# Altium schematic sheet toplevel.SchDoc
size A
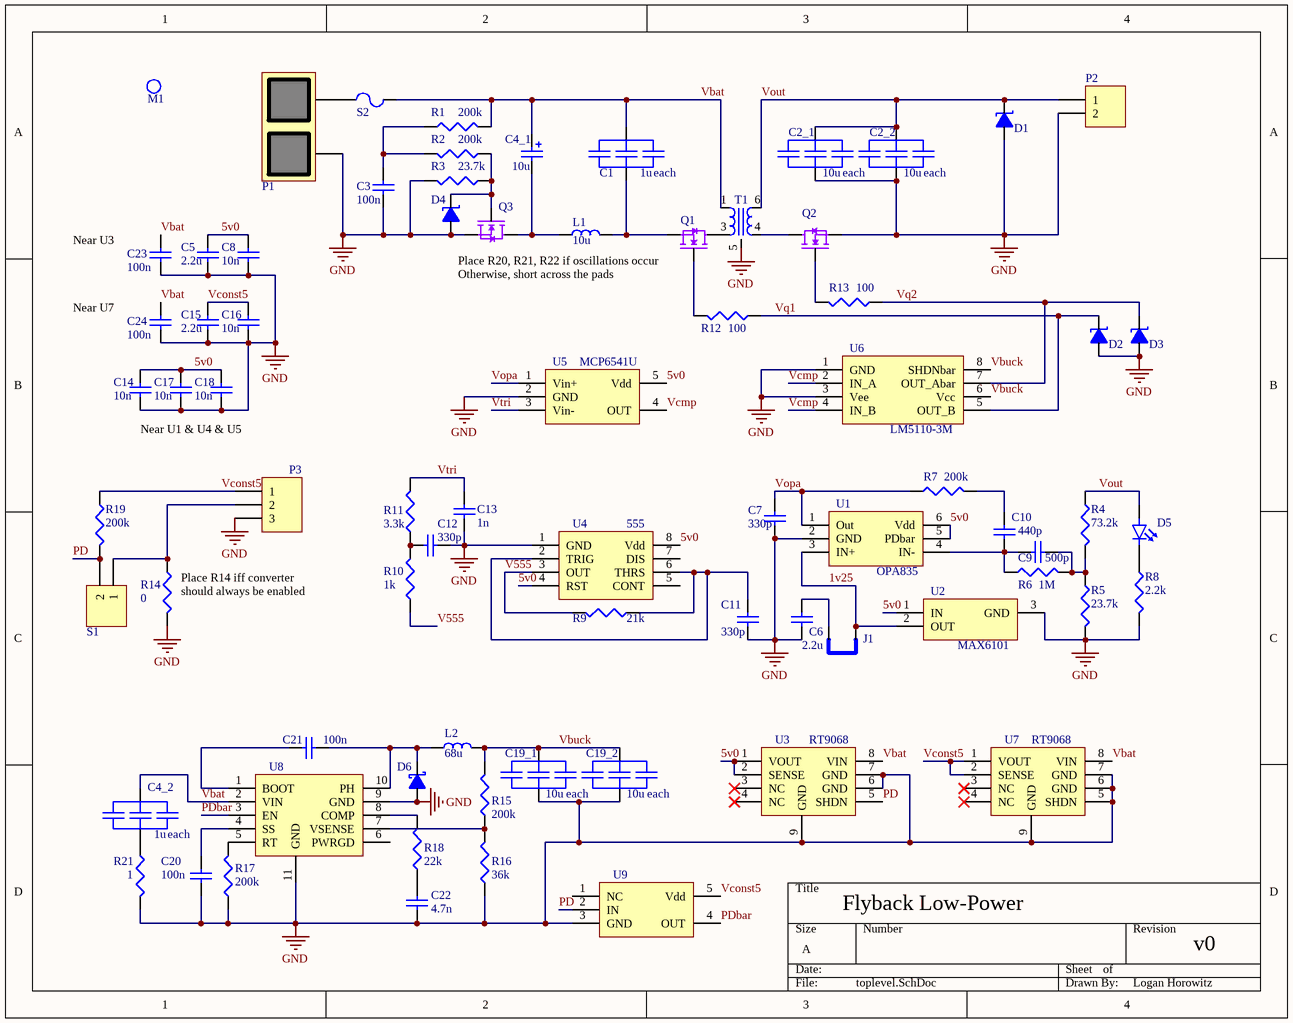
[diagram p0: toplevel.SchDoc]

## Parts
C1  value 1u  [tricap_0805]  (hidden comment: TriCap)
C2_1  value 10u  [tricap_0603]  (hidden comment: TriCap)
C2_2  value 10u  [tricap_0603]  (hidden comment: TriCap)
C3  value 100n  [SMD0603_cap]  (hidden comment: Cap)
C4_1  value 10u  [cap_radial_d]  (hidden comment: Cap)
C4_2  value 1u  [tricap_0805]  (hidden comment: TriCap)
C5  value 2.2u  [SMD0603_cap]  (hidden comment: Cap)
C6  value 2.2u  [SMD0603_cap]  (hidden comment: Cap)
C7  value 330p  [SMD0603_cap]  (hidden comment: Cap)
C8  value 10n  [SMD0603_cap]  (hidden comment: Cap)
C9  value 500p  [SMD0603_cap]  (hidden comment: Cap)
C10  value 440p  [SMD0603_cap]  (hidden comment: Cap)
C11  value 330p  [SMD0603_cap]  (hidden comment: Cap)
C12  value 330p  [SMD0603_cap]  (hidden comment: Cap)
C13  value 1n  [SMD0603_cap]  (hidden comment: Cap)
C14  value 10n  [SMD0603_cap]  (hidden comment: Cap)
C15  value 2.2u  [SMD0603_cap]  (hidden comment: Cap)
C16  value 10n  [SMD0603_cap]  (hidden comment: Cap)
C17  value 10n  [SMD0603_cap]  (hidden comment: Cap)
C18  value 10n  [SMD0603_cap]  (hidden comment: Cap)
C19_1  value 10u  [tricap_0603]  (hidden comment: TriCap)
C19_2  value 10u  [tricap_0603]  (hidden comment: TriCap)
C20  value 100n  [SMD0603_cap]  (hidden comment: Cap)
C21  value 100n  [SMD0603_cap]  (hidden comment: Cap)
C22  value 4.7n  [SMD0603_cap]  (hidden comment: Cap)
C23  value 100n  [SMD0603_cap]  (hidden comment: Cap)
C24  value 100n  [SMD0603_cap]  (hidden comment: Cap)
D1  Zener  [SOD-323F]  (value not drawn)
D2  Zener  [SOD-323F]  (value not drawn)
D3  Zener  [SOD-323F]  (value not drawn)
D4  Zener  [SOD-323F]  (value not drawn)
D5  LED  [SMD0603 POLARIZED]  (value not drawn)
D6  Shottky  [sod-128]  (value not drawn)
J1  Jumper  [jumper]  (value not drawn)
L1  value 10u  [Nonstandard_10uH]  (hidden comment: Inductor)
L2  value 68u  [Nonstandard_68uH]  (hidden comment: Inductor)
M1  MountHole  [MountHole_M3]  (value not drawn)
P1  Microfit 2x1  [Microfit 2x1]  (value not drawn)
P2  Header  [Header 2x1]  (value not drawn)
P3  Header  [HEADER 3X1]  (value not drawn)
Q1  GaN PowerFET  [GaN Bumped Die]  (value not drawn)
Q2  GaN PowerFET  [GaN Bumped Die]  (value not drawn)
Q3  GaN PowerFET  [GaN Bumped Die]  (value not drawn)
R1  value 200k  [SMD0603]  (hidden comment: Res)
R2  value 200k  [SMD0603]  (hidden comment: Res)
R3  value 23.7k  [SMD0603]  (hidden comment: Res)
R4  value 73.2k  [SMD0603]  (hidden comment: Res)
R5  value 23.7k  [SMD0603]  (hidden comment: Res)
R6  value 1M  [SMD0603]  (hidden comment: Res)
R7  value 200k  [SMD0603]  (hidden comment: Res)
R8  value 2.2k  [SMD0603]  (hidden comment: Res)
R9  value 21k  [SMD0603]  (hidden comment: Res)
R10  value 1k  [SMD0603]  (hidden comment: Res)
R11  value 3.3k  [SMD0603]  (hidden comment: Res)
R12  value 100  [SMD0603]  (hidden comment: Res)
R13  value 100  [SMD0603]  (hidden comment: Res)
R14  value 0  [SMD0603]  (hidden comment: Res)
R15  value 200k  [SMD0603]  (hidden comment: Res)
R16  value 36k  [SMD0603]  (hidden comment: Res)
R17  value 200k  [SMD0603]  (hidden comment: Res)
R18  value 22k  [SMD0603]  (hidden comment: Res)
R19  value 200k  [SMD0603]  (hidden comment: Res)
R21  value 1  [SMD0603]  (hidden comment: Res)
S1  Header  [Header 2x1]  (value not drawn)
S2  Fuse_SMD  [smd1206]  (value not drawn)
T1  Transformer  [P1408]  (value not drawn)
U1  OPA835  [SOT23-6L]
U2  MAX6101  [sot23]
U3  RT9068  [soic-8_pad]
U4  555  [SOIC8]
U5  MCP6541U  [SOT23-5Lead]
U6  LM5110-3M  [soic8]
U7  RT9068  [soic-8_pad]
U8  TPS54260  [MSSOP-10]  (value not drawn)
U9  NC7SZ04  [SOT23-5Lead]  (value not drawn)

## Nets
GND: C2_1.1 C2_2.1 C3.1 C5.2 C6.2 C7.2 C8.2 C11.1 C12.1 C13.2 C14.2 C15.2 C16.2 C17.2 C18.2 C19_1.1 C19_2.1 C20.2 C22.2 C23.1 C24.1 D1.A D2.A D3.A D4.A D6.A P1.2 P2.2 P3.3 Q2.S Q3.S R3.2 R5.2 R8.2 R14.2 R16.1 R17.1 R21.2 T1.5(A) U1.2(GND) U2.3(GND) U3.6(GND) U3.7(GND) U3.9(GND) U4.1(GND) U5.2(GND) U6.1(GND) U6.3(Vee) U7.5(SHDN) U7.6(GND) U7.7(GND) U7.9(GND) U8.9(GND) U8.11(GND) U9.3(GND)
1v25: J1.1 U1.3(IN+) U2.2(OUT)
5v0: C5.1 C8.1 C14.1 C17.1 C18.1 U1.5(PDbar) U1.6(Vdd) U2.1(IN) U3.1(VOUT) U3.2(SENSE) U4.4(RST) U4.8(Vdd) U5.5(Vdd)
PD: R19.2 S1.2 U3.5(SHDN) U9.2(IN)
PDbar: U8.3(EN) U9.4(OUT)
V555: R9.2 R10.1 U4.3(OUT)
Vbat: C1.2 C4_1.1 C4_2.2 C23.2 C24.2 R1.2 S2.2 T1.1(Source) U3.8(VIN) U7.8(VIN) U8.2(VIN)
Vbuck: C19_1.2 C19_2.2 L2.2(Source) R15.2 U6.6(Vcc) U6.8(SHDNbar)
Vcmp: U5.4(OUT) U6.2(IN_A) U6.4(IN_B)
Vconst5: C15.1 C16.1 P3.1 R19.1 U7.1(VOUT) U7.2(SENSE) U9.5(Vdd)
Vopa: C7.1 R7.1 U1.1(Out) U5.1(Vin+)
Vout: C2_1.2 C2_2.2 D1.K D5.1(Anode_(+)) P2.1 R4.1 T1.6(A)
Vq1: D2.K R12.1 U6.5(OUT_B)
Vq2: D3.K R13.1 U6.7(OUT_Abar)
Vtri: C13.1 R11.2 U5.3(Vin-)
NetC1_1: C1.1 L1.2(Source) Q1.S
NetC3_2: C3.2 R1.1 R2.2
NetC4_1_2: C4_1.2 L1.1(Source) Q3.D
NetC4_2_1: C4_2.1 R21.1
NetC6_1: C6.1 J1.2
NetC9_1: C9.1 R4.2 R5.1 R6.2
NetC9_2: C9.2 C10.2 R6.1 U1.4(IN-)
NetC10_1: C10.1 R7.2
NetC11_2: C11.2 R9.1 U4.2(TRIG) U4.6(THRS)
NetC12_2: C12.2 R10.2 R11.1
NetC20_1: C20.1 U8.4(SS)
NetC21_1: C21.1 U8.1(BOOT)
NetC21_2: C21.2 D6.K L2.1(Source) U8.10(PH)
NetC22_1: C22.1 R18.1
NetD4_K: D4.K Q3.G R2.1 R3.1
NetD5_2: D5.2(Cathode_(-)) R8.1
NetP1_1: P1.1 S2.1
NetP3_2: P3.2 R14.1 S1.1
NetQ1_D: Q1.D T1.3(Source)
NetQ1_G: Q1.G R12.2
NetQ2_D: Q2.D T1.4(A)
NetQ2_G: Q2.G R13.2
NetR15_1: R15.1 R16.2 U8.7(VSENSE)
NetR17_2: R17.2 U8.5(RT)
NetR18_2: R18.2 U8.8(COMP)

Not connected (* = marked no-connect by the designer): U3 3(NC)* 4(NC)*; U4 5(CONT) 7(DIS); U7 3(NC)* 4(NC)*; U8 6(PWRGD); U9 1(NC)

## Notes on the sheet
- (near C23) Near U3
- (near Q1) Place R20, R21, R22 if oscillations occur
- Otherwise, short across the pads
- Near U7
- Near U1 & U4 & U5
- (near R14) Place R14 iff converter
- (near R14) should always be enabled
- Flyback Low-Power
- v0
- Logan Horowitz
- (in symbol TriCap) each

## Library data of the parts
C3 C5-C18 C20-C24 = Capacitor Ceramic: Ceramic Chip Capacitor
C4_1 = Capacitor Polarized: Polarized Capacitor (Surface Mount)
L1 L2 = Inductor: Code_IEC: 1005; Published: 8-Jun-2000; LatestRevisionDate: 29-May-2009; LatestRevisionNote: IPC-7351 Footprint Added.; PackageReference: 0402-A; Publisher: Altium Limited; PackageDescription: Chip Inductor; Code_JEITA: 0402
P2 S1 = Header 2x1: Header, 2-Pin
P3 = Header 3x1: Header, 2-Pin
R1-R19 R21 = Resistor